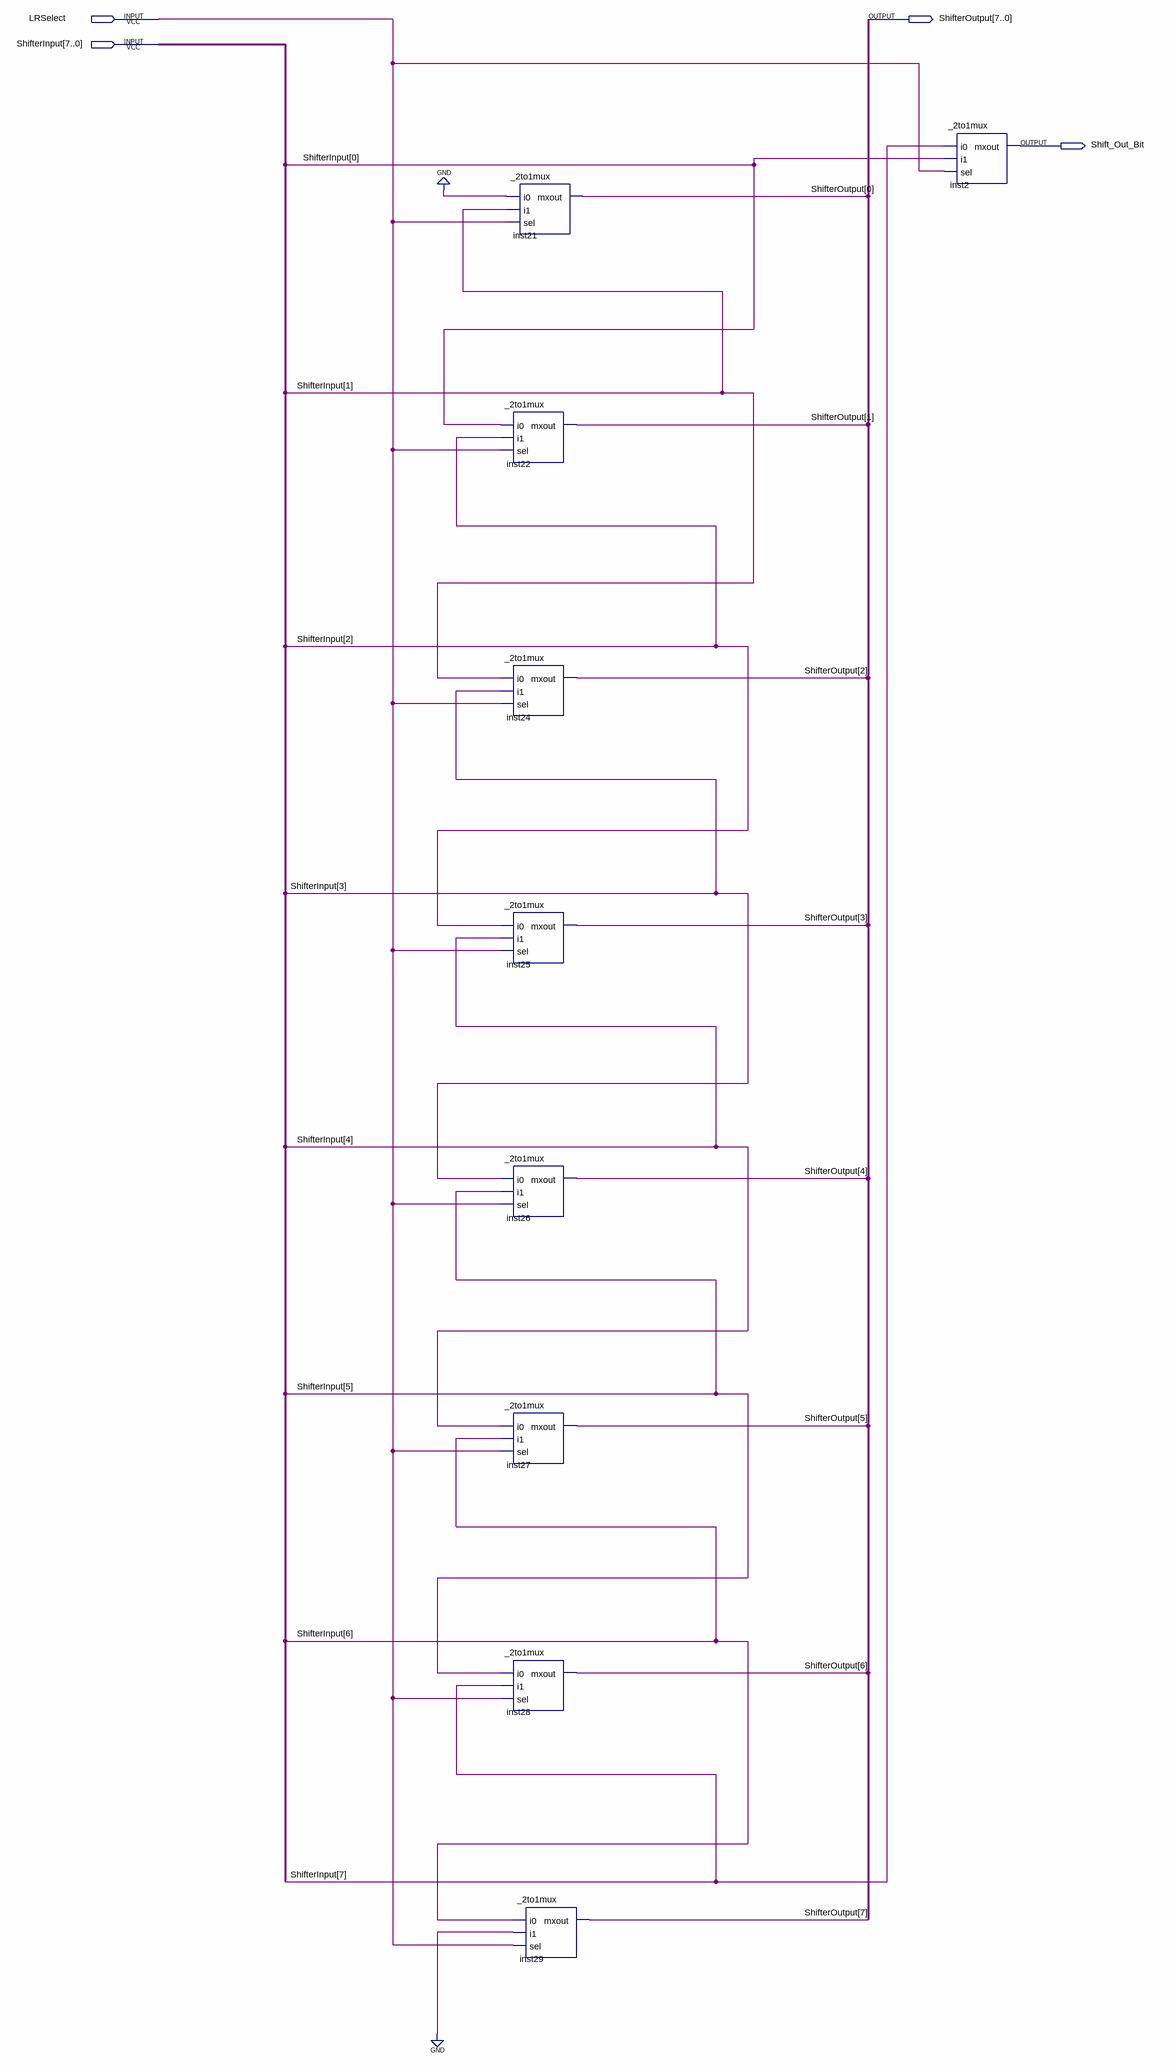
[diagram p0: schematic sheet]
// Quartus schematic ShiftNoDff.bdf as structural Verilog: 9 symbols, 4 pins
module ShiftNoDff (
  input  LRSelect,
  input  [7:0] ShifterInput,
  output [7:0] ShifterOutput,
  output Shift_Out_Bit
);

  _2to1mux inst22 (.i0(ShifterInput[0]), .i1(ShifterInput[2]), .sel(LRSelect), .mxout(ShifterOutput[1]));
  _2to1mux inst24 (.i0(ShifterInput[1]), .i1(ShifterInput[3]), .sel(LRSelect), .mxout(ShifterOutput[2]));
  _2to1mux inst25 (.i0(ShifterInput[2]), .i1(ShifterInput[4]), .sel(LRSelect), .mxout(ShifterOutput[3]));
  _2to1mux inst26 (.i0(ShifterInput[3]), .i1(ShifterInput[5]), .sel(LRSelect), .mxout(ShifterOutput[4]));
  _2to1mux inst27 (.i0(ShifterInput[4]), .i1(ShifterInput[6]), .sel(LRSelect), .mxout(ShifterOutput[5]));
  _2to1mux inst28 (.i0(ShifterInput[5]), .i1(ShifterInput[7]), .sel(LRSelect), .mxout(ShifterOutput[6]));
  _2to1mux inst21 (.i0(1'b0), .i1(ShifterInput[1]), .sel(LRSelect), .mxout(ShifterOutput[0]));
  _2to1mux inst29 (.i0(ShifterInput[6]), .i1(1'b0), .sel(LRSelect), .mxout(ShifterOutput[7]));
  _2to1mux inst2 (.i0(ShifterInput[7]), .i1(ShifterInput[0]), .sel(LRSelect), .mxout(Shift_Out_Bit));
endmodule
